# EAGLE design hemera_dock (EAGLE 5.10)
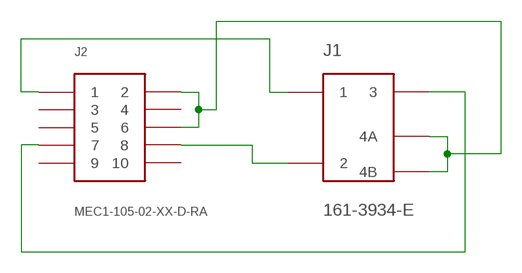
[diagram p0: schematic, sheet 1]

## Parts
J1  161-3934-E  [161-3934-E]
J2  MEC1-105-02-XX-D-RA  [MEC1-105-02-XX-D-RA]

## Nets
N$1: J1.P$2 J2.P$8
N$2: J1.P$4.1(4A) J1.P$4.2(4B) J2.P$2 J2.P$6
N$3: J1.P$1 J2.P$1
N$4: J1.P$3 J2.P$7
Unconnected: J2.P$3 J2.P$4 J2.P$5 J2.P$9 J2.P$10

## Library data of the parts
J1 = brad:161-3934-E: 3.5mm SMT Kobiconn Audio Jack
J2 = brad:MEC1-105-02-XX-D-RA: Samtec right angle 1mm mini edge connector. 5 positions, 10 pins

## Board
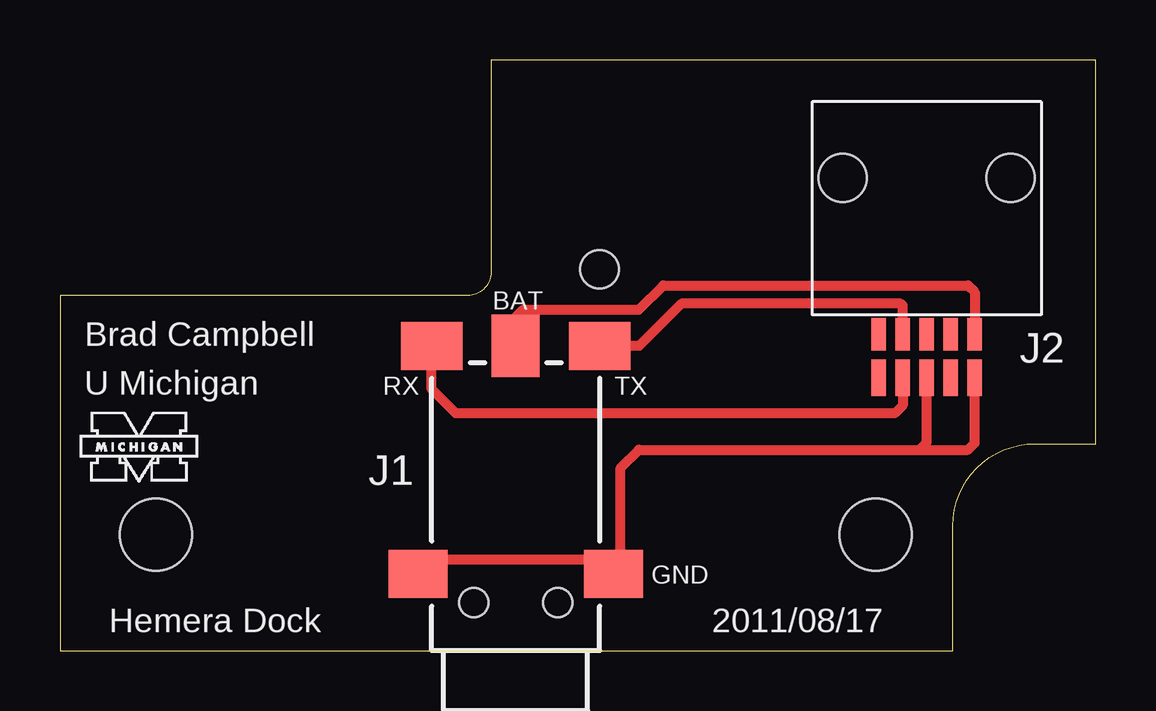
[diagram p1: board, top side]

Size 43.18 x 24.64 mm. Coordinates in mm from the lower left corner, seen from the top.
Outline: 0,0 37.22,0 37.22,5.22 arc-90 40.64,8.64 43.18,8.64 43.18,24.64 17.97,24.64 17.97,15.79 arc-90 17,14.82 0,14.82 0,0
Copper layers (1*16): Top 0.0178mm / dielectric 1.4986mm / Bottom 0.0178mm
Design rules "SSC-EAGLE-2Lyr_v1.0.0.3": minimum track width 6mil, minimum drill 14mil, track to track 6mil, track to pad 6mil, pad to pad 6mil, via to via 6mil, smd to smd 6mil, copper to edge 20mil, drill to drill 16mil, minimum pad ring 8mil, minimum via ring 8mil, stop-mask expansion 3mil, vias tented up to drill 0mil, thermal gap 10mil
Holes 3 mm at 4,4.85 34,4.85
Holes 1.6 mm at 22.5,15.91

### Footprints (pad centres in the part's own frame; a part is rotated, then mirrored left to right if it is on the bottom)
161-3934-E = smd 2.6 x 2: P$1 6.95,0 | smd 2 x 2.55: P$2 6.95,3.5; P$3 6.95,-3.5 | smd 2 x 2.46: P$4.1 -2.55,-4.075; P$4.2 -2.55,4.075 | hole 1.2: -3.75,1.75; -3.75,-1.75
MEC1-105-02-XX-D-RA = smd 0.61 x 1.35: P$1 -2,0; P$3 -1,0; P$5 0,0; P$7 1,0; P$9 2,0 | smd 0.61 x 1.52: P$2 -2,1.815; P$4 -1,1.815; P$6 0,1.815; P$8 1,1.815; P$10 2,1.815 | hole 2: 3.5,-6.517; -3.5,-6.517

### Placement (x,y rotation side)
J1  19,5.77 90 top
J2  36.13,13.21 180 top
U$1  [UMICH]  0.76,6.86 0 top

### Tracks (layer width: path | path; a pad name or v marks a point on that pad's centre or on a via)
N$1
  Top 0.406: J2.P$8 35.13,10.24 34.8,9.91 16.51,9.91 15.5,10.92 J1.P$2
N$2
  Top 0.406: J1.P$4.2 15.57,3.81 22.43,3.81 J1.P$4.1 23.37,3.51 23.37,7.62 24.13,8.38 35.81,8.38 | J2.P$6 36.13,8.7 35.81,8.38 | J2.P$2 38.13,8.66 37.85,8.38 35.81,8.38
N$3
  Top 0.406: J2.P$1 38.13,14.96 37.85,15.24 25.15,15.24 24.13,14.22 19.3,14.22 19,13.92 J1.P$1
N$4
  Top 0.406: J2.P$7 35.13,14.4 35.05,14.48 25.91,14.48 24.15,12.72 J1.P$3

### Text on the board
tNames: BAT | Brad Campbell | U Michigan | RX | TX | GND | Hemera Dock | 2011/08/17